# Altium schematic sheet 14 ETHERNET.SchDoc: CM4 IO
size 297 x 209 mm; Page Create Date: March  8, 1995; Page Number: 14; Page Size: A4; Comment: radxa_1010; Page Count: 19; RevCode: V1.10; Doc: 14 ETHERNET; DsnPath: D:\WMS\黄工\[RC126]CM4_IO_V1.10\[RC126]_V1.10\CM4 IO_V1.10.DSN; SchematicName: CM4 IO V1.10; PageName: 14 ETHERNET; PageSize: A4; TopSchematic: True
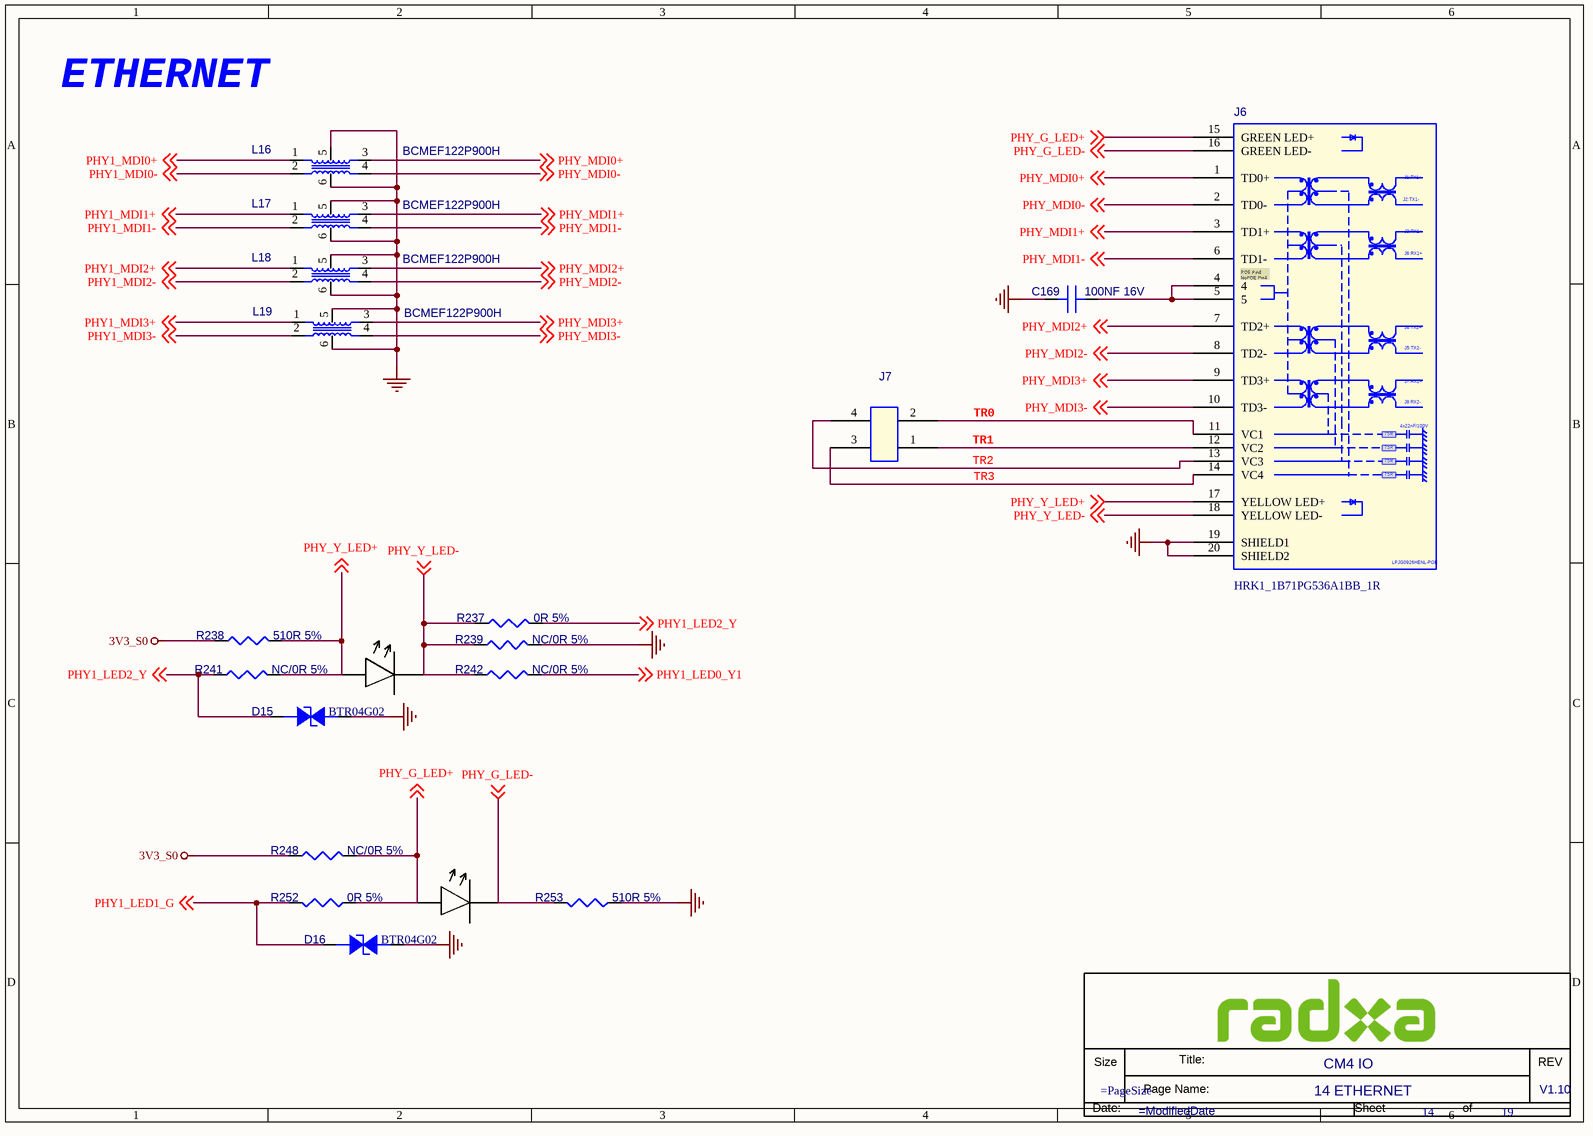
[diagram p0: 14 ETHERNET.SchDoc]

## Parts
*  Doc: 14 ETHERNET  RevCode: V1.10  Title: CM4 IO  Page Number: 14  Page Count: 19  (hidden comment: radxa_1010)  (graphical)
C169  100NF 16V  [C0201]
D15  BTR04G02  [DFN1006-2L]
D16  BTR04G02  [DFN1006-2L]
J6  HRK1_1B71PG536A1BB_1R  [RJ45_LED_TH22_LIE]
J7  (no value)  [CONM_TH2X2_2D54_STA]
L16  BCMEF122P900H  [CML_SM6_0D6_1D5]
L17  BCMEF122P900H  [CML_SM6_0D6_1D5]
L18  BCMEF122P900H  [CML_SM6_0D6_1D5]
L19  BCMEF122P900H  [CML_SM6_0D6_1D5]
R237  0R 5%  [R0402]
R238  510R 5%  [R0402]
R239  NC/0R 5%  [R0402]
R241  NC/0R 5%  [R0402]
R242  NC/0R 5%  [R0402]
R248  NC/0R 5%  [R0402]
R252  0R 5%  [R0402]
R253  510R 5%  [R0402]

## Nets
3V3_S0: R238.1 R248.2
GND: C169.1(A) D15.2(CATHODE) D16.2(CATHODE) J6.19(SHIELD1) J6.20(SHIELD2) L16.5 L16.6 L17.5 L17.6 L18.5 L18.6 L19.5 L19.6 R239.1 R253.2
PHY1_LED0_Y1: R242.2 ; off-sheet PHY1_LED0_Y1
PHY1_LED1_G: D16.1(ANODE) R252.1 ; off-sheet PHY1_LED1_G
PHY1_LED2_Y: D15.1(ANODE) R237.2 R241.1 ; off-sheet PHY1_LED2_Y
PHY1_MDI0+: L16.1(R1) ; off-sheet PHY1_MDI0+
PHY1_MDI0-: L16.2(R2) ; off-sheet PHY1_MDI0-
PHY1_MDI1+: L17.1(R1) ; off-sheet PHY1_MDI1+
PHY1_MDI1-: L17.2(R2) ; off-sheet PHY1_MDI1-
PHY1_MDI2+: L18.1(R1) ; off-sheet PHY1_MDI2+
PHY1_MDI2-: L18.2(R2) ; off-sheet PHY1_MDI2-
PHY1_MDI3+: L19.1(R1) ; off-sheet PHY1_MDI3+
PHY1_MDI3-: L19.2(R2) ; off-sheet PHY1_MDI3-
PHY_G_LED+: J6.15(GREEN_LED+) R248.1 R252.2 ; off-sheet PHY_G_LED+
PHY_G_LED-: J6.16(GREEN_LED-) R253.1 ; off-sheet PHY_G_LED-
PHY_MDI0+: J6.1(TD0+) L16.3(R4) ; off-sheet PHY_MDI0+
PHY_MDI0-: J6.2(TD0-) L16.4(R3) ; off-sheet PHY_MDI0-
PHY_MDI1+: J6.3(TD1+) L17.3(R4) ; off-sheet PHY_MDI1+
PHY_MDI1-: J6.6(TD1-) L17.4(R3) ; off-sheet PHY_MDI1-
PHY_MDI2+: J6.7(TD2+) L18.3(R4) ; off-sheet PHY_MDI2+
PHY_MDI2-: J6.8(TD2-) L18.4(R3) ; off-sheet PHY_MDI2-
PHY_MDI3+: J6.9(TD3+) L19.3(R4) ; off-sheet PHY_MDI3+
PHY_MDI3-: J6.10(TD3-) L19.4(R3) ; off-sheet PHY_MDI3-
PHY_Y_LED+: J6.17(YELLOW_LED+) R238.2 R241.2 ; off-sheet PHY_Y_LED+
PHY_Y_LED-: J6.18(YELLOW_LED-) R237.1 R239.2 R242.1 ; off-sheet PHY_Y_LED-
TR0: J6.11(VC1) J7.2
TR1: J6.12(VC2) J7.1
TR2: J6.13(VC3) J7.4
TR3: J6.14(VC4) J7.3
NetC169_2: C169.2(B) J6.4 J6.5

## Notes on the sheet
- ETHERNET
- (in symbol LPJG0926HENL) J1:TX1+; J2:TX1-; J3:RX1+; J6:RX1+; POE:Pin6 / NoPOE:Pin4; J4:TX2+; J5:TX2-; J7:RX2+; J8:RX2-; 4x22nF/100V; 75R; LPJG0926HENL-POE
- (in symbol radxa_1010) Size; Title:; REV; Page Name:; Date:; Sheet; of

## Library data of the parts
C169 = C: SMD  0201  100NF  16V  X5R  ±20%  ROHS; PARTS: 1; Part Reference: C169; Part Number: A1C01.00099; OriginalSymbolOrigin: (0,30); PKG_TYPE: CAP2-100-250; LEVEL: STD; PINSWAP: (A,B); Preferred: 6715f349cd0bc5; Value: 100NF 16V; Part Type: 陶瓷电容
D15 = ESD: SMD  编带  0402  BTR04G02  B-tron  ROHS; Part Reference: D15; Part Number: A1D02.00002; Parameter: ESD-台舟 ESD5341N-封装 esd0402; ID: DE-E0004; Temp Coeff: -50℃ ~ +125℃; PCB Footprint: ESD_D0402; Value: BTR04G02; Part Type: 二极管-ESD管-桥堆-TVS管
D16 = ESD: SMD  编带  0402  BTR04G02  B-tron  ROHS; Part Reference: D16; Part Number: A1D02.00002; Parameter: ESD-台舟 ESD5341N-封装 esd0402; ID: DE-E0004; Temp Coeff: -50℃ ~ +125℃; PCB Footprint: ESD_D0402; Value: BTR04G02; Part Type: 二极管-ESD管-桥堆-TVS管
J6 = LPJG0926HENL: DIP  母座  千兆网  带POE功能  18PIN  21.5*16*13.7mm  HRK1-1B71PG536A1BB-1R  镀镍  带指示灯  无弹片  左绿右黄  ROHS; Part Reference: J6; Part Number: A1J03.00012; Parameter: 连接器-带POE功能的集成变压器RJ45; Value: HRK1_1B71PG536A1BB_1R; Part Type: RJ45座
J7 = CON_2X2: DIP  排针座  2*2PIN  180度  2.54mm脚距  中间朔高2.5mm  针长一端6.1mm  另一端3.0mm  黑色  PH2.54 2*02P L=11.6/3.0  S/T  国意英  ROHS; Part Reference: J7; Part Number: A1J01.00011; Temp Coeff: -40℃ to +105℃; Preferred: 6715f349cd0bc5; Part Type: 排座
L16 = BCMEF122P900H: SMD  BCMEF122P900H  90R  6PIN  带ESD  ±25%  B-tron  ROHS; Part Number: A1L03.00001; Part Reference: L16; Temp Coeff: -40℃ to +105℃; Preferred: 6715f349cd0bc5; PCB Footprint: CML_SM6_0D55_1; Value: BCMEF122P900H; Part Type: 共模电感
L17 = BCMEF122P900H: SMD  BCMEF122P900H  90R  6PIN  带ESD  ±25%  B-tron  ROHS; Part Number: A1L03.00001; Part Reference: L17; Temp Coeff: -40℃ to +105℃; Preferred: 6715f349cd0bc5; PCB Footprint: CML_SM6_0D55_1; Value: BCMEF122P900H; Part Type: 共模电感
L18 = BCMEF122P900H: SMD  BCMEF122P900H  90R  6PIN  带ESD  ±25%  B-tron  ROHS; Part Number: A1L03.00001; Part Reference: L18; Temp Coeff: -40℃ to +105℃; Preferred: 6715f349cd0bc5; PCB Footprint: CML_SM6_0D55_1; Value: BCMEF122P900H; Part Type: 共模电感
L19 = BCMEF122P900H: SMD  BCMEF122P900H  90R  6PIN  带ESD  ±25%  B-tron  ROHS; Part Number: A1L03.00001; Part Reference: L19; Temp Coeff: -40℃ to +105℃; Preferred: 6715f349cd0bc5; PCB Footprint: CML_SM6_0D55_1; Value: BCMEF122P900H; Part Type: 共模电感
R237 = R: SMD  0201  0R  1/20W  ±5%  ROHS; Part Reference: R237; Part Number: A1R01.00027; PCB Footprint: R0201; Temp Coeff: －55℃ ~ ＋125℃; Value: 0R 5%; Part Type: 贴片电阻
R238 = R: SMD  0201  510R  1/20W  ±5%  ROHS; Part Reference: R238; Part Number: A1R01.00019; PCB Footprint: R0201; Value: 510R 5%; Part Type: 贴片电阻
R239 = R: SMD  0201  0R  1/20W  ±5%  ROHS; Part Reference: R239; Part Number: A1R01.00027; PCB Footprint: R0201; Temp Coeff: －55℃ ~ ＋125℃; Value: NC/0R 5%; Part Type: 贴片电阻
R241 = R: SMD  0201  0R  1/20W  ±5%  ROHS; Part Reference: R241; Part Number: A1R01.00027; PCB Footprint: R0201; Temp Coeff: －55℃ ~ ＋125℃; Value: NC/0R 5%; Part Type: 贴片电阻
R242 = R: SMD  0201  0R  1/20W  ±5%  ROHS; Part Reference: R242; Part Number: A1R01.00027; PCB Footprint: R0201; Temp Coeff: －55℃ ~ ＋125℃; Value: NC/0R 5%; Part Type: 贴片电阻
R248 = R: SMD  0201  0R  1/20W  ±5%  ROHS; Part Reference: R248; Part Number: A1R01.00027; PCB Footprint: R0201; Temp Coeff: －55℃ ~ ＋125℃; Value: NC/0R 5%; Part Type: 贴片电阻
R252 = R: SMD  0201  0R  1/20W  ±5%  ROHS; Part Reference: R252; Part Number: A1R01.00027; PCB Footprint: R0201; Temp Coeff: －55℃ ~ ＋125℃; Value: 0R 5%; Part Type: 贴片电阻
R253 = R: SMD  0201  510R  1/20W  ±5%  ROHS; Part Reference: R253; Part Number: A1R01.00019; PCB Footprint: R0201; Value: 510R 5%; Part Type: 贴片电阻
* = radxa_1010: Page Create Date: March  8, 1995; Page Size: =PageSize; Page Modify Date: =ModifiedDate